# Altium schematic sheet I2C_SW.SchDoc
size A4; Organization: Altium Limited; Address1: L3, 12a Rodborough Rd; Address2: Frenchs Forest; Address3: NSW; Address4: Australia 2086
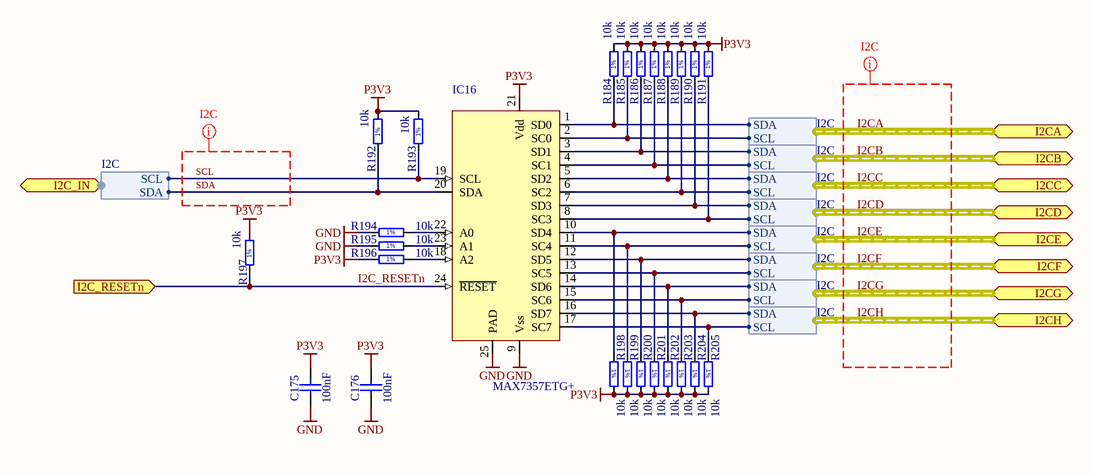
[diagram p0: I2C_SW.SchDoc]

## Parts
C175  100nF  [CAPC0603X33N]
C176  100nF  [CAPC0603X33N]
IC16  MAX7357ETG+  [HVQFN24]
R184  10k  [RESC1005X40N]
R185  10k  [RESC1005X40N]
R186  10k  [RESC1005X40N]
R187  10k  [RESC1005X40N]
R188  10k  [RESC1005X40N]
R189  10k  [RESC1005X40N]
R190  10k  [RESC1005X40N]
R191  10k  [RESC1005X40N]
R192  10k  [RESC1005X40N]
R193  10k  [RESC1005X40N]
R194  10k  [RESC1005X40N]
R195  10k  [RESC1005X40N]
R196  10k  [RESC1005X40N]
R197  10k  [RESC1005X40N]
R198  10k  [RESC1005X40N]
R199  10k  [RESC1005X40N]
R200  10k  [RESC1005X40N]
R201  10k  [RESC1005X40N]
R202  10k  [RESC1005X40N]
R203  10k  [RESC1005X40N]
R204  10k  [RESC1005X40N]
R205  10k  [RESC1005X40N]

## Ports
I2C_IN (harness I2C), I2C_RESETn (in), I2CA (harness I2C), I2CB (harness I2C), I2CC (harness I2C), I2CD (harness I2C), I2CE (harness I2C), I2CF (harness I2C), I2CG (harness I2C), I2CH (harness I2C)

## Harnesses
I2C: SCL, SDA

## Nets
GND: C175.1 C176.1 IC16.9(Vss) IC16.25(PAD) R194.1 R195.1
P3V3: C175.2 C176.2 IC16.21(Vdd) R184.2 R185.2 R186.2 R187.2 R188.2 R189.2 R190.2 R191.2 R192.2 R193.2 R196.1 R197.2 R198.2 R199.2 R200.2 R201.2 R202.2 R203.2 R204.2 R205.2
I2C_RESETn: IC16.24(~{RESET}) R197.1 ; port I2C_RESETn
I2CA.SCL: IC16.2(SC0) R185.1 ; port I2CA.SCL
I2CA.SDA: IC16.1(SD0) R184.1 ; port I2CA.SDA
I2CB.SCL: IC16.4(SC1) R187.1 ; port I2CB.SCL
I2CB.SDA: IC16.3(SD1) R186.1 ; port I2CB.SDA
I2CC.SCL: IC16.6(SC2) R189.1 ; port I2CC.SCL
I2CC.SDA: IC16.5(SD2) R188.1 ; port I2CC.SDA
I2CD.SCL: IC16.8(SC3) R191.1 ; port I2CD.SCL
I2CD.SDA: IC16.7(SD3) R190.1 ; port I2CD.SDA
I2CE.SCL: IC16.11(SC4) R199.1 ; port I2CE.SCL
I2CE.SDA: IC16.10(SD4) R198.1 ; port I2CE.SDA
I2CF.SCL: IC16.13(SC5) R201.1 ; port I2CF.SCL
I2CF.SDA: IC16.12(SD5) R200.1 ; port I2CF.SDA
I2CG.SCL: IC16.15(SC6) R203.1 ; port I2CG.SCL
I2CG.SDA: IC16.14(SD6) R202.1 ; port I2CG.SDA
I2CH.SCL: IC16.17(SC7) R205.1 ; port I2CH.SCL
I2CH.SDA: IC16.16(SD7) R204.1 ; port I2CH.SDA
SCL: IC16.19(SCL) R193.1 ; port I2C_IN.SCL
SDA: IC16.20(SDA) R192.1 ; port I2C_IN.SDA
NetIC16_18: IC16.18(A2) R196.2
NetIC16_22: IC16.22(A0) R194.2
NetIC16_23: IC16.23(A1) R195.2

## Buses and harness runs
harness I2CA = port I2CA
harness I2CB = port I2CB
harness I2CC = port I2CC
harness I2CD = port I2CD
harness I2CE = port I2CE
harness I2CF = port I2CF
harness I2CG = port I2CG
harness I2CH = port I2CH

## Layout directives
net class I2C: I2CA, I2CB, I2CC, I2CD, I2CE, I2CF, I2CG, I2CH, SCL, SDA

## Notes on the sheet
- (in symbol R0402_10K_1%_0.0625W_100PPM) 1%

## Library data of the parts
C175 C176 = CC0201_100NF_6.3V_10%_X5R: Non-polarised capacitor; Part Description: SMD Multilayer Chip Ceramic Capacitor; Manufacturer: GENERIC; Manufacturer1 Part Number: 02016D104KAT2A; Voltage: 6.3V; TC: X5R; Tolerance: ±10%; Table: Capacitors SMD; Part Number: CC0201_100NF_6.3V_10%_X5R; Component Kind: Standard; Component Type: Standard; Pin Count: 2; Value: 100nF; Status: Not Recommended; Manufacturer Part Number: CC0201_100NF_6.3V_10%_X5R; Case: 0201; Mounted: Yes; Socket: No; SMD: Yes; Manufacturer1 Example: AVX; Manufacturer1 ComponentHeight: 0.33mm; HelpURL: \\cern.ch\dfs\Applications\Altium\Datasheets\CC0201_X5R_AVX.pdf; Author: CERN DEM JLC; CreateDate: 2007-12-03; LatestRevisionDate: 2007-12-03
IC16 = IIC_MUX_MAX7357ETG+: 8-channel I2C-bus multiplexer with reset, INT and timeout
R184-R205 = R0402_10K_1%_0.0625W_100PPM: Resistor - 1%; Part Description: General Purpose Thick Film Chip Resistor; Manufacturer: GENERIC; Manufacturer1 Part Number: 232270671003L; TC: ±100ppm/°C; Table: Resistors SMD; Part Number: R0402_10K_1%_0.0625W_100PPM; Component Kind: Standard; Component Type: Standard; Pin Count: 2; Value: 10k; Status: Not recommended; Power: 0.0625W; Tolerance: ±1%; Manufacturer Part Number: R0402_10K_1%_0.0625W_100PPM; Case: 0402; Mounted: Yes; Socket: No; SMD: Yes; Manufacturer1 Example: YAGEO PHYCOMP; Manufacturer1 ComponentHeight: 0.4mm; HelpURL: \\cern.ch\dfs\Applications\Altium\Datasheets\R0402_Phycomp_RC0402.pdf; Author: CERN DEM JLC; CreateDate: 2007-12-03; LatestRevisionDate: 2012-10-17